# Altium schematic sheet 03-Power.SchDoc
size A; ApprovedDate: 04/02/2019; AssemblyNumber: ECE315-F19
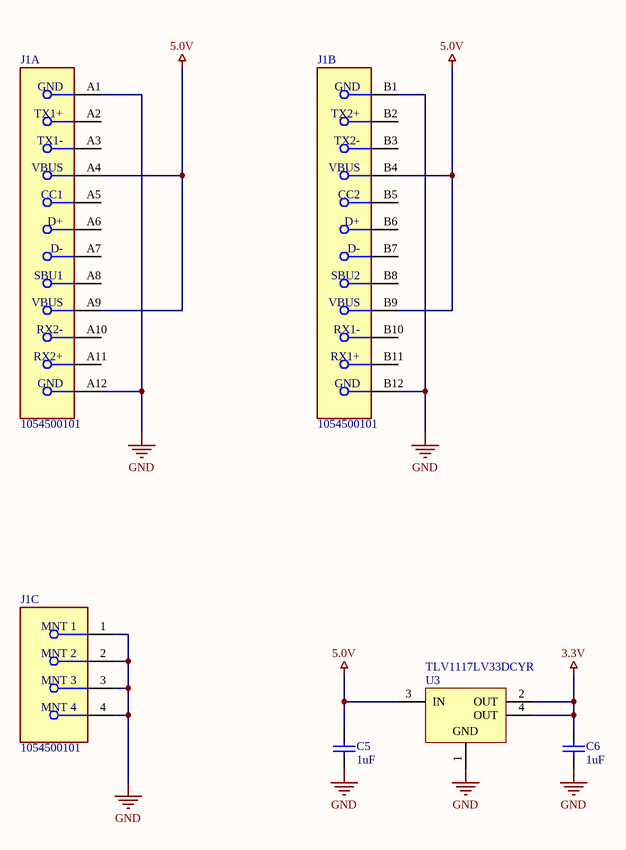
[diagram p0: 03-Power.SchDoc]

## Parts
C5  Capacitance: 1uF  [CAPC3216X180X50ML20T25]  (hidden comment: C1206C105K3RACTU)
C6  Capacitance: 1uF  [CAPC3216X180X50ML20T25]  (hidden comment: C1206C105K3RACTU)
J1  1054500101  [FP-1054500101-MFG]  (parts A,B,C of 3)
U3  TLV1117LV33DCYR  [DCY0004A_N]

## Nets
3.3V: C6.2 U3.2(OUT) U3.4(OUT)
5.0V: C5.2 J1.A4(VBUS) J1.A9(VBUS) J1.B4(VBUS) J1.B9(VBUS) U3.3(IN)
GND: C5.1 C6.1 J1.1(MNT_1) J1.2(MNT_2) J1.3(MNT_3) J1.4(MNT_4) J1.A1(GND) J1.A12(GND) J1.B1(GND) J1.B12(GND) U3.1(GND)

Not connected (* = marked no-connect by the designer): J1 A2(TX1+) A3(TX1-) A5(CC1) A6(D+) A7(D-) A8(SBU1) A10(RX2-) A11(RX2+) B2(TX2+) B3(TX2-) B5(CC2) B6(D+) B7(D-) B8(SBU2) B10(RX1-) B11(RX1+)

## Library data of the parts
C5 C6 = CMP-2000-04991-1: Chip Capacitor, 1 uF, +/- 10%, 25 V, -55 to 125 degC, 1206 (3216 Metric), RoHS, Tape and Reel; Manufacturer: Kemet; Temperature Coefficient / Code: +/-15%; Dielectric: X7R; Voltage Rating DC: 25V; Capacitance - nF: 1000nF; Class: Class1; Case Length: 3.2mm; Type: SMDMLCCX7R6.3-250VDCCommericalGrade; Case Width: 1.6mm; Product: GeneralTypeMLCCs; Datasheet URL: https://ciiva.com/datasheet-click-18194173?src=ciiva&sig=6daff8c4; Operating Temperature Range: -55Cto+125C; Series: C1206C; RoHS: Details; Product Category: MultilayerCeramicCapacitorsMLCC-SMD/SMT; Manufacturer URL: http://www.kemet.com/; Minimum Operating Temperature: -55C; Dimensions: 1.6mmWx3.2mmLx1.6mmH; Termination Style: SMD/SMT; Brand: Kemet; Packaging: Reel; Package / Case: 1206(3216metric); Case Code - mm: 3216; Datasheet Version: Jul-14; Factory Pack Quantity: 2000; Package Description: 2-Pin Surface Mount Device, Body 3.2 x 1.6 mm; Tolerance: 10%; Package Reference: 1206; Case Height: 1.6mm; Case Code - in: 1206; Maximum Operating Temperature: +125C; Voltage Rating: 25V; Supplier 1: Digi-Key; Supplier Part Number 1: 399-C1206C105K3RAC7800CT-ND; Manufacturer Part Number: C1206C105K3RACTU; Category: Ceramic Capacitors; Stock 1: 908349; Pricing 1: 1=0.24000, 10=0.16700, 50=0.10000, 100=0.08440, 500=0.05778, 1000=0.05111 (USD); Mount: Surface Mount; Case/Package: 1206; Case Code (Imperial): 1206; Case Code (Metric): 3216; Min Operating Temperature: -55°C; Max Operating Temperature: 125°C; Voltage Rating (DC): 25V; Package Quantity: 1; Termination: SMD/SMT; Construction: Flat; Voltage: 25V; Length: 3.2mm; Width: 0.063inch; Height: 1.6mm; Depth: 1.6mm; Thickness: 0.055inch; Radiation Hardening: No; Reach SVHC Compliant: No; RoHS Compliant: Yes
J1 = CMP-04767-000004-1: CONN RCP USB3.1 TYPEC 24P SMD RA; Manufacturer: Molex; Number Of Contacts: 24; Voltage Rating: 30V; Shielding: true; Is Female: yes; Current Rating: 0.25/1.25/5A; Pitch: 0.5mm; Conn Orientation: Right Angle; Package: 0; Height: 3.44mm; Footprint Url: https://www.molex.com/pdm_docs/sd/1054500101_sd.pdf; Device Class L1: Connectors; Category: Conn; Device Class L2: USB Connectors; Digikey Description: CONN RCP USB3.1 TYPEC 24P SMD RA; Contact Material: Gold,Nickel; Mouser Description: USB Shielded I/O Receptacle; Type C; Right Angle; Surface Mount; Gold over Nickel; ComponentLink2Description: Datasheet; Lead Free: Yes; Automotive: No; Temperature Range High: +85°C; RoHS: TRUE; Octopart: https://octopart.com/105450-0101-molex-68082325; ComponentLink2URL: https://www.molex.com/webdocs/datasheets/pdf/en-us/1054500101_IO_CONNECTORS.pdf; Temperature: -30°C to +85°C; Usb Standard: USB 3.1; Temperature Range Low: -30°C; Device Class L3: unset; Manufacturer Part Number: 1054500101
U3 = CMP-0395-00503-2: =Section; Manufacturer: Texas Instruments; Vout Adj(Min)(V): 3.3; Vdo(Typ)(mV): 1200; Iq(Typ)(mA): 0.05; Accuracy(%): 2; Iout(Max)(A): 1; Eco-Plan: Green (RoHS & no Sb/Br); SubFamily: Single Channel LDO; Vin(Max)(V): 5.5; Dropout Voltage: 570mV; Output Current: 1A; Max Input Voltage: 5.5V; Min Input Voltage: 2V; Polarity: Positive; Quiescent Current: 50uA; Min Output Voltage: 3.3V; Accuracy: 2%; Output Type: Fixed; Power Supply Rejection Ratio (PSRR): 75dB; PackageReference: DCY0004A; PackageDescription: 4-Pin Plastic Small Outline, Body 3.5 x 6.5 mm, Pitch 2.3 mm; Vout Adj(Max)(V): 3.3; Mounting Technology: Surface Mount; ComponentLink2Description: Datasheet; ComponentLink1Description: Manufacturer URL; PartNumber: TLV1117LV33DCYR; ComponentLink3Description: Package Specification; ComponentLink1URL: http://www.ti.com/; ComponentLink2URL: http://www.ti.com/general/docs/lit/getliterature.tsp?genericPartNumber=TLV1117LV33&fileType=pdf; Fixed Output Options(V): 3.3; PackageVersion: 4202506/B; Vin(Min)(V): 2; DatasheetVersion: SBVS160A; ComponentLink3URL: http://www.ti.com/litv/pdf/mpds094a; Code_JEDEC: TO-261; Supplier 1: Digi-Key; Supplier Part Number 1: 296-28778-1-ND; Manufacturer Part Number: TLV1117LV33DCYR; RoHS: Yes; Category: Voltage Regulators - Linear; Stock 1: 3051; Pricing 1: 1=0.35000, 10=0.28200, 25=0.25800, 100=0.19200, 250=0.17400, 500=0.14400, 1000=0.10800 (USD); Case/Package: SOT-223-4; Number of Pins: 4; Weight: 0.009171oz; Min Operating Temperature: -40°C; Max Operating Temperature: 125°C; Package Quantity: 2500; Packaging: Cut Tape; Max Output Current: 1A; Number of Regulators: 1; Max Output Voltage: 3.3V; Series: -; Operating Supply Current: 50uA; Output Configuration: Positive; Lead Free: Lead Free; RoHS Compliant: Yes; ComponentLink4URL: https://datasheet.ciiva.com/46443/1857581-46443437.pdf?src-supplier=Element14; ComponentLink4Description: https://datasheet.ciiva.com/46443/1857581-46443437.pdf?src-supplier=Element14; ComponentLink5URL: https://datasheet.ciiva.com/46443/1857581-46443438.pdf?src-supplier=Element14; ComponentLink5Description: https://datasheet.ciiva.com/46443/1857581-46443438.pdf?src-supplier=Element14; ComponentLink6URL: https://datasheet.ciiva.com/46443/1857581-46443450.pdf?src-supplier=Element14; ComponentLink6Description: https://datasheet.ciiva.com/46443/1857581-46443450.pdf?src-supplier=Element14; ComponentLink7URL: https://datasheet.ciiva.com/2060/tlv1117lv-2060227.pdf?src-supplier=Digi-Key; ComponentLink7Description: https://datasheet.ciiva.com/2060/tlv1117lv-2060227.pdf?src-supplier=Digi-Key; ComponentLink8URL: https://datasheet.ciiva.com/2060/tlv1117lv-2060226.pdf?src-supplier=Digi-Key; ComponentLink8Description: https://datasheet.ciiva.com/2060/tlv1117lv-2060226.pdf?src-supplier=Digi-Key; ComponentLink9URL: https://datasheet.ciiva.com/2060/tlv1117lv-2060228.pdf?src-supplier=Digi-Key; ComponentLink9Description: https://datasheet.ciiva.com/2060/tlv1117lv-2060228.pdf?src-supplier=Digi-Key